# Altium project TEST—AD.PrjPcb
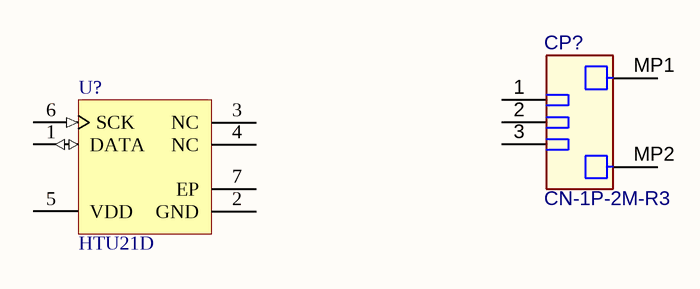
[diagram p0: test.SchDoc]
1 sheet, 2 parts. Net scope: global (net labels, ports and power ports of the same name join across sheets).
Board file: Test.PcbDoc

## Sheet test.SchDoc
size A4; SheetNumber: 1; SheetTotal: 1

### Parts
CP?  CN-1P-2M-R3  [MR30PW-FB-Footprint-1]
U?  HTU21D  [MEAS-SON-6_V]

### Nets

Not connected (* = marked no-connect by the designer): CP? 1 2 3 MP1 MP2; U? 1(DATA) 2(GND) 3(NC) 4(NC) 5(VDD) 6(SCK) 7(EP)

### Library data of the parts
CP? = CMP-002-00056-2: AMASS 500V 15A   0.8 mOhm; Pins: 5
U? = CMP-010-00009-2: Digital Relative Humidity Sensor with Temperature Output, 1.5 to 3.6 V, -40 to 125 degC, 6-Pin SON, RoHS, Tape and Reel; Manufacturer: Measurement Specialties; Min Supply Voltage: 1.5V; Nominal Supply Voltage: 3V; Max Supply Voltage: 3.6V; Interface: Serial; Sensor Type: Humidity; Min Operating Temperature: -40°C; Package Description: 6-Pin Small Outline No-Lead, Body 3 x 3 mm, Pitch 1 mm, Thermal Pad 2.4 x 1.5 mm; Max Operating Temperature: 125°C; RoHS Compliant: True; Pins: 6; Packaging: TapeandReel; Case/Package: DFN; Datasheet URL: https://datasheet.ciiva.com/28624/1792510-28624306.pdf; Mounting Technology: SM; Datasheet Version: Rev. 2, 07/2013; Package Reference: SON-6